# Altium schematic sheet Stepdown.SchDoc
size A
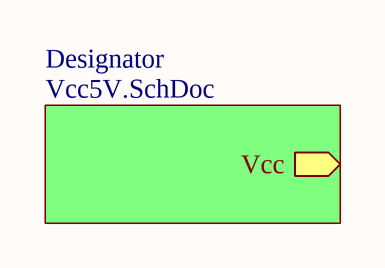
[diagram p0: Stepdown.SchDoc]

## Sub-sheets
Designator = Vcc5V.SchDoc: Vcc (out)